# Altium schematic sheet SchematicSheet.SchDoc
size A3; SheetNumber: 1; SheetTotal: 1
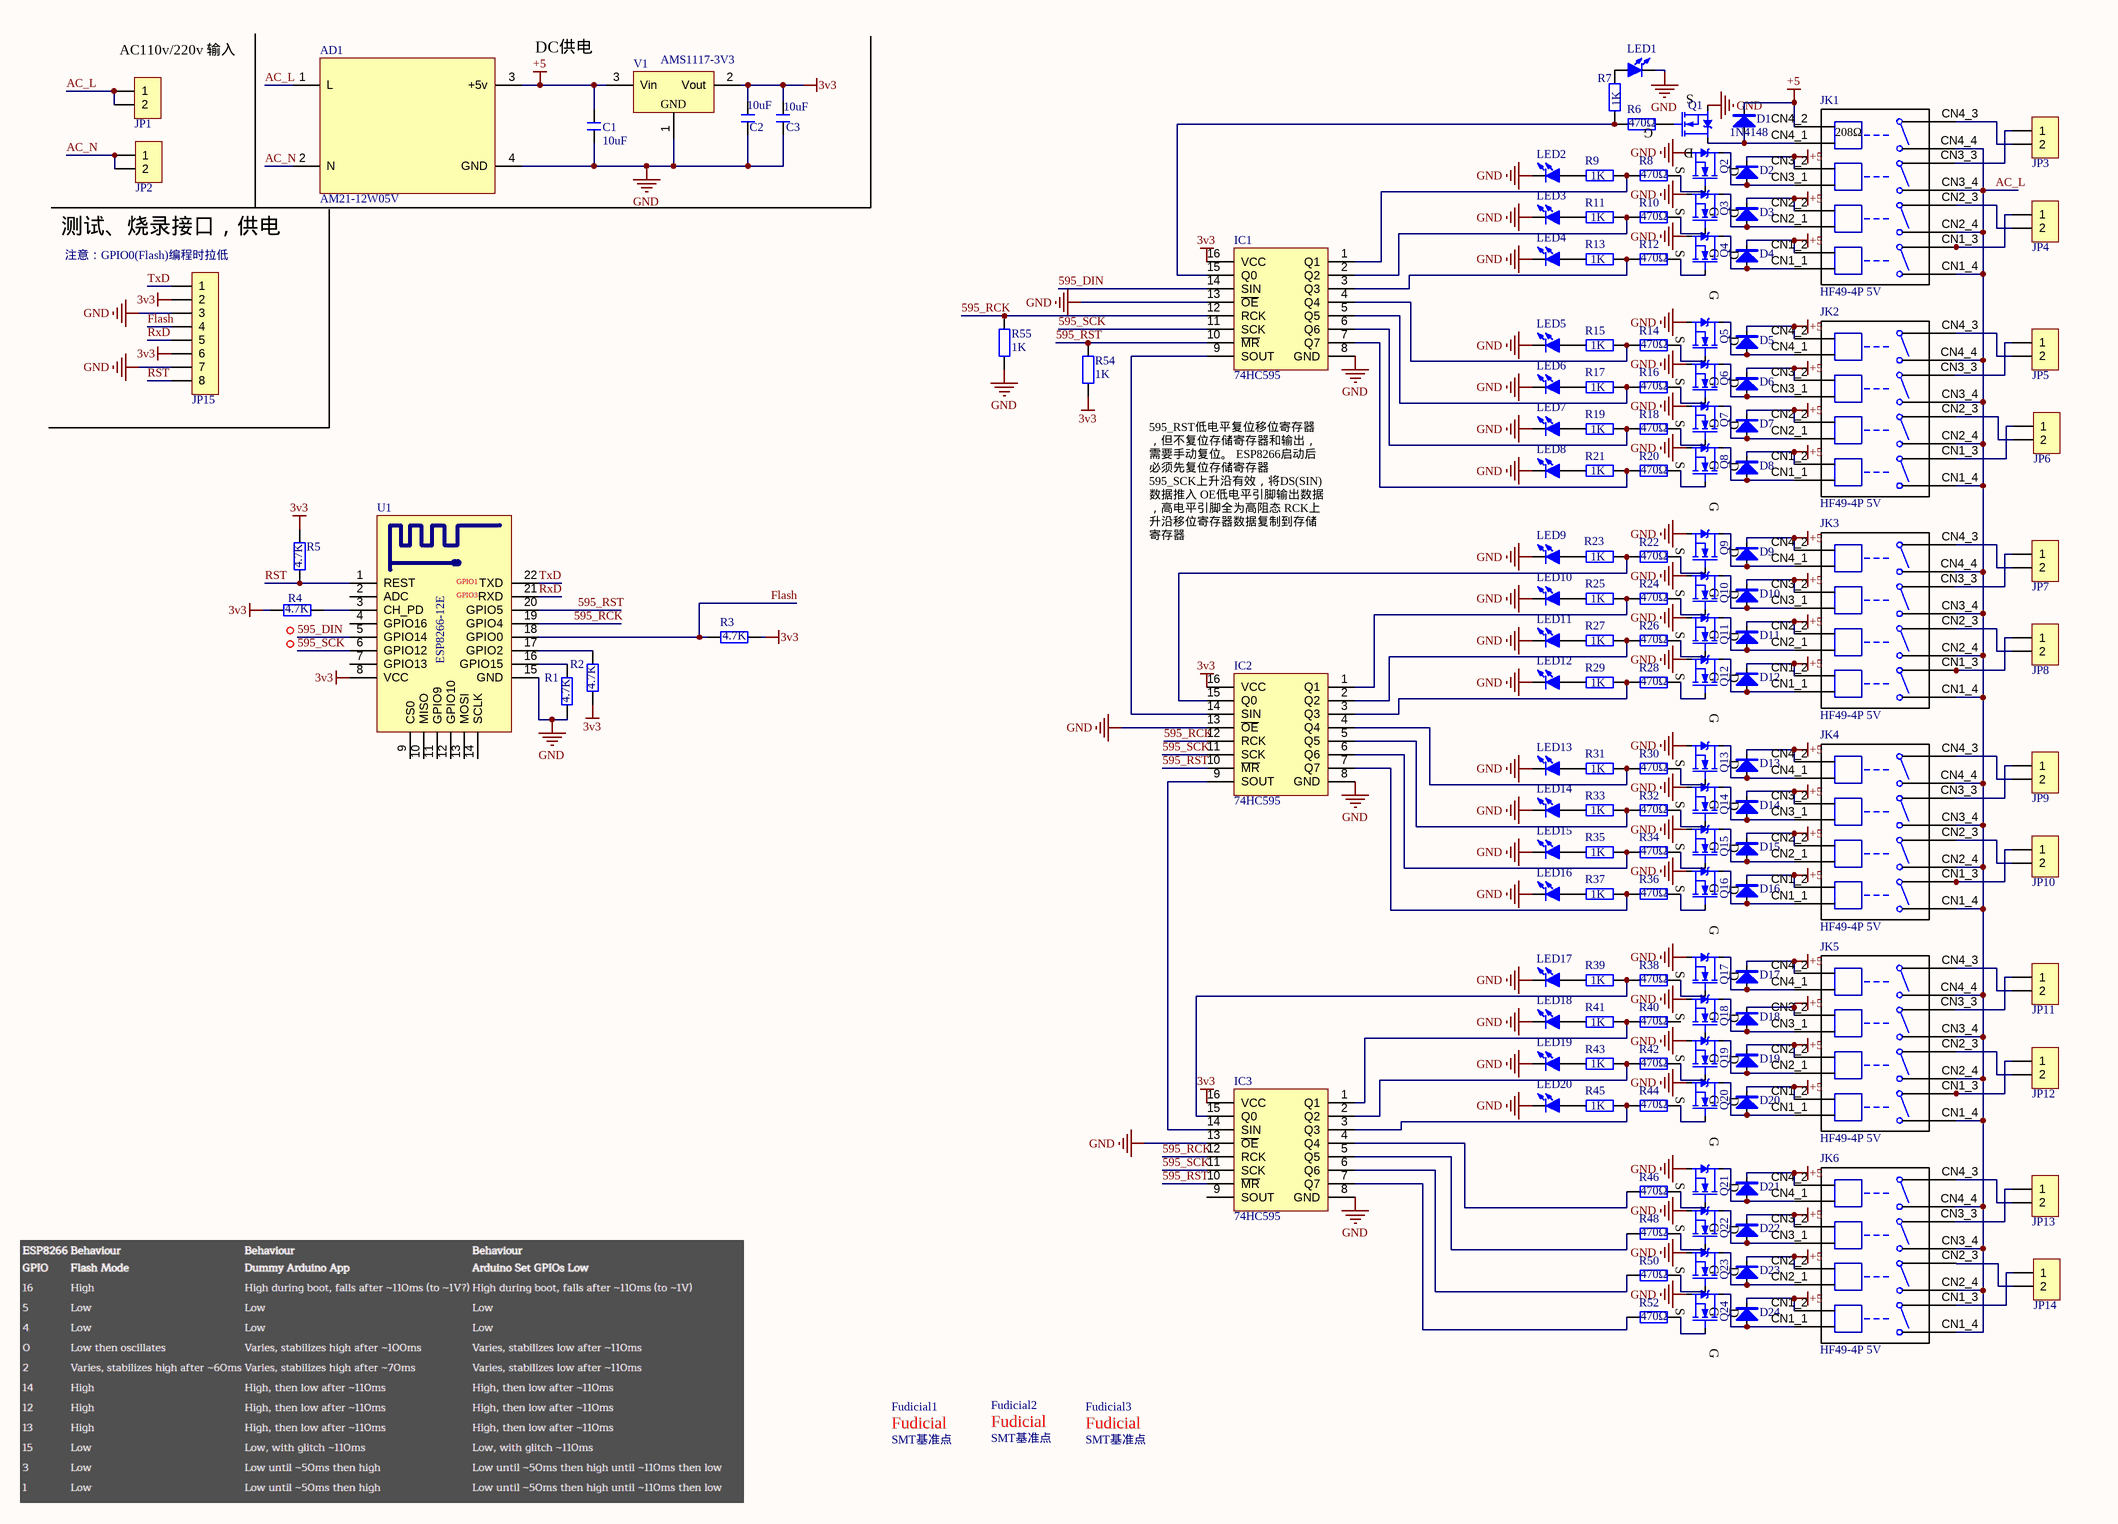
[diagram p0: SchematicSheet.SchDoc]

## Parts
AD1  AM21-12W05V  [AM21-xWxxV]
C1  10uF  [0603R]
C2  10uF  [0603R]
C3  10uF  [0603R]
D1  1N4148  [SOD-123]
D2  1N4148  [SOD-123]  (value not drawn)
D3  1N4148  [SOD-123]  (value not drawn)
D4  1N4148  [SOD-123]  (value not drawn)
D5  1N4148  [SOD-123]  (value not drawn)
D6  1N4148  [SOD-123]  (value not drawn)
D7  1N4148  [SOD-123]  (value not drawn)
D8  1N4148  [SOD-123]  (value not drawn)
D9  1N4148  [SOD-123]  (value not drawn)
D10  1N4148  [SOD-123]  (value not drawn)
D11  1N4148  [SOD-123]  (value not drawn)
D12  1N4148  [SOD-123]  (value not drawn)
D13  1N4148  [SOD-123]  (value not drawn)
D14  1N4148  [SOD-123]  (value not drawn)
D15  1N4148  [SOD-123]  (value not drawn)
D16  1N4148  [SOD-123]  (value not drawn)
D17  1N4148  [SOD-123]  (value not drawn)
D18  1N4148  [SOD-123]  (value not drawn)
D19  1N4148  [SOD-123]  (value not drawn)
D20  1N4148  [SOD-123]  (value not drawn)
D21  1N4148  [SOD-123]  (value not drawn)
D22  1N4148  [SOD-123]  (value not drawn)
D23  1N4148  [SOD-123]  (value not drawn)
D24  1N4148  [SOD-123]  (value not drawn)
Fudicial1  SMT基准点  [Fudicials]  (no BOM)
Fudicial2  SMT基准点  [Fudicials]  (no BOM)
Fudicial3  SMT基准点  [Fudicials]  (no BOM)
IC1  74HC595  [SOP16_M]
IC2  74HC595  [SOP16_M]
IC3  74HC595  [SOP16_M]
JK1  HF49-4P 5V  [HF49F-XXXX-1H11(1H12)-4P焊座]
JK2  HF49-4P 5V  [HF49F-XXXX-1H11(1H12)-4P焊座]
JK3  HF49-4P 5V  [HF49F-XXXX-1H11(1H12)-4P焊座]
JK4  HF49-4P 5V  [HF49F-XXXX-1H11(1H12)-4P焊座]
JK5  HF49-4P 5V  [HF49F-XXXX-1H11(1H12)-4P焊座]
JK6  HF49-4P 5V  [HF49F-XXXX-1H11(1H12)-4P焊座]
JP1  HDR-1X2  [KF301-5.0-2P]  (value not drawn)
JP2  HDR-1X2  [KF301-5.0-2P]  (value not drawn)
JP3  HDR-1X2  [KF301-5.0-2P]  (value not drawn)
JP4  HDR-1X2  [KF301-5.0-2P]  (value not drawn)
JP5  HDR-1X2  [KF301-5.0-2P]  (value not drawn)
JP6  HDR-1X2  [KF301-5.0-2P]  (value not drawn)
JP7  HDR-1X2  [KF301-5.0-2P]  (value not drawn)
JP8  HDR-1X2  [KF301-5.0-2P]  (value not drawn)
JP9  HDR-1X2  [KF301-5.0-2P]  (value not drawn)
JP10  HDR-1X2  [KF301-5.0-2P]  (value not drawn)
JP11  HDR-1X2  [KF301-5.0-2P]  (value not drawn)
JP12  HDR-1X2  [KF301-5.0-2P]  (value not drawn)
JP13  HDR-1X2  [KF301-5.0-2P]  (value not drawn)
JP14  HDR-1X2  [KF301-5.0-2P]  (value not drawn)
JP15  HDR-2X4  [1.27 2x4Pin]  (value not drawn)
LED1  红色  [LED 0603R]  (value not drawn)
LED2  红色  [LED 0603R]  (value not drawn)
LED3  红色  [LED 0603R]  (value not drawn)
LED4  红色  [LED 0603R]  (value not drawn)
LED5  红色  [LED 0603R]  (value not drawn)
LED6  红色  [LED 0603R]  (value not drawn)
LED7  红色  [LED 0603R]  (value not drawn)
LED8  红色  [LED 0603R]  (value not drawn)
LED9  红色  [LED 0603R]  (value not drawn)
LED10  红色  [LED 0603R]  (value not drawn)
LED11  红色  [LED 0603R]  (value not drawn)
LED12  红色  [LED 0603R]  (value not drawn)
LED13  红色  [LED 0603R]  (value not drawn)
LED14  红色  [LED 0603R]  (value not drawn)
LED15  红色  [LED 0603R]  (value not drawn)
LED16  红色  [LED 0603R]  (value not drawn)
LED17  红色  [LED 0603R]  (value not drawn)
LED18  红色  [LED 0603R]  (value not drawn)
LED19  红色  [LED 0603R]  (value not drawn)
LED20  红色  [LED 0603R]  (value not drawn)
Q1  AO3400  [SOT23]  (value not drawn)
Q2  AO3400  [SOT23]  (value not drawn)
Q3  AO3400  [SOT23]  (value not drawn)
Q4  AO3400  [SOT23]  (value not drawn)
Q5  AO3400  [SOT23]  (value not drawn)
Q6  AO3400  [SOT23]  (value not drawn)
Q7  AO3400  [SOT23]  (value not drawn)
Q8  AO3400  [SOT23]  (value not drawn)
Q9  AO3400  [SOT23]  (value not drawn)
Q10  AO3400  [SOT23]  (value not drawn)
Q11  AO3400  [SOT23]  (value not drawn)
Q12  AO3400  [SOT23]  (value not drawn)
Q13  AO3400  [SOT23]  (value not drawn)
Q14  AO3400  [SOT23]  (value not drawn)
Q15  AO3400  [SOT23]  (value not drawn)
Q16  AO3400  [SOT23]  (value not drawn)
Q17  AO3400  [SOT23]  (value not drawn)
Q18  AO3400  [SOT23]  (value not drawn)
Q19  AO3400  [SOT23]  (value not drawn)
Q20  AO3400  [SOT23]  (value not drawn)
Q21  AO3400  [SOT23]  (value not drawn)
Q22  AO3400  [SOT23]  (value not drawn)
Q23  AO3400  [SOT23]  (value not drawn)
Q24  AO3400  [SOT23]  (value not drawn)
R1  4.7K  [0603R]
R2  4.7K  [0603R]
R3  4.7K  [0603R]
R4  4.7K  [0603R]
R5  4.7K  [0603R]
R6  470Ω  [0603R]
R7  1K  [0603R]
R8  470Ω  [0603R]
R9  1K  [0603R]
R10  470Ω  [0603R]
R11  1K  [0603R]
R12  470Ω  [0603R]
R13  1K  [0603R]
R14  470Ω  [0603R]
R15  1K  [0603R]
R16  470Ω  [0603R]
R17  1K  [0603R]
R18  470Ω  [0603R]
R19  1K  [0603R]
R20  470Ω  [0603R]
R21  1K  [0603R]
R22  470Ω  [0603R]
R23  1K  [0603R]
R24  470Ω  [0603R]
R25  1K  [0603R]
R26  470Ω  [0603R]
R27  1K  [0603R]
R28  470Ω  [0603R]
R29  1K  [0603R]
R30  470Ω  [0603R]
R31  1K  [0603R]
R32  470Ω  [0603R]
R33  1K  [0603R]
R34  470Ω  [0603R]
R35  1K  [0603R]
R36  470Ω  [0603R]
R37  1K  [0603R]
R38  470Ω  [0603R]
R39  1K  [0603R]
R40  470Ω  [0603R]
R41  1K  [0603R]
R42  470Ω  [0603R]
R43  1K  [0603R]
R44  470Ω  [0603R]
R45  1K  [0603R]
R46  470Ω  [0603R]
R48  470Ω  [0603R]
R50  470Ω  [0603R]
R52  470Ω  [0603R]
R54  1K  [0603R]
R55  1K  [0603R]
U1  ESP8266-12E  [ESP_12E/F]
V1  AMS1117-3V3  [SOT223_N]

## Nets
3v3: C2.1 C3.1 IC1.16(VCC) IC2.16(VCC) IC3.16(VCC) JP15.2 JP15.6 R2.2 R3.2 R4.1 R5.2 R54.2 U1.8(VCC) V1.2(Vout)
+5: AD1.3(+5v) C1.1 D1.2(K) D2.2(K) D3.2(K) D4.2(K) D5.2(K) D6.2(K) D7.2(K) D8.2(K) D9.2(K) D10.2(K) D11.2(K) D12.2(K) D13.2(K) D14.2(K) D15.2(K) D16.2(K) D17.2(K) D18.2(K) D19.2(K) D20.2(K) D21.2(K) D22.2(K) D23.2(K) D24.2(K) JK1.CN1_2 JK1.CN2_2 JK1.CN3_2 JK1.CN4_2 JK2.CN1_2 JK2.CN2_2 JK2.CN3_2 JK2.CN4_2 JK3.CN1_2 JK3.CN2_2 JK3.CN3_2 JK3.CN4_2 JK4.CN1_2 JK4.CN2_2 JK4.CN3_2 JK4.CN4_2 JK5.CN1_2 JK5.CN2_2 JK5.CN3_2 JK5.CN4_2 JK6.CN1_2 JK6.CN2_2 JK6.CN3_2 JK6.CN4_2 V1.3(Vin)
GND: AD1.4(GND) C1.2 C2.2 C3.2 IC1.8(GND) IC1.13(~{OE}) IC2.8(GND) IC2.13(~{OE}) IC3.8(GND) IC3.13(~{OE}) JP15.3 JP15.7 LED1.2(K) LED2.2(K) LED3.2(K) LED4.2(K) LED5.2(K) LED6.2(K) LED7.2(K) LED8.2(K) LED9.2(K) LED10.2(K) LED11.2(K) LED12.2(K) LED13.2(K) LED14.2(K) LED15.2(K) LED16.2(K) LED17.2(K) LED18.2(K) LED19.2(K) LED20.2(K) Q1.3(S) Q2.3(S) Q3.3(S) Q4.3(S) Q5.3(S) Q6.3(S) Q7.3(S) Q8.3(S) Q9.3(S) Q10.3(S) Q11.3(S) Q12.3(S) Q13.3(S) Q14.3(S) Q15.3(S) Q16.3(S) Q17.3(S) Q18.3(S) Q19.3(S) Q20.3(S) Q21.3(S) Q22.3(S) Q23.3(S) Q24.3(S) R1.2 R55.2 U1.15(GND) V1.1(GND)
595_DIN: IC1.14(SIN) U1.5(GPIO14)
595_RCK: IC1.12(RCK) IC2.12(RCK) IC3.12(RCK) R55.1 U1.19(GPIO4)
595_RST: IC1.10(~{MR}) IC2.10(~{MR}) IC3.10(~{MR}) R54.1 U1.20(GPIO5)
595_SCK: IC1.11(SCK) IC2.11(SCK) IC3.11(SCK) U1.6(GPIO12)
AC_L: AD1.1(L) JK1.CN1_4 JK1.CN2_4 JK1.CN3_4 JK1.CN4_4 JK2.CN1_4 JK2.CN2_4 JK2.CN3_4 JK2.CN4_4 JK3.CN1_4 JK3.CN2_4 JK3.CN3_4 JK3.CN4_4 JK4.CN1_4 JK4.CN2_4 JK4.CN3_4 JK4.CN4_4 JK5.CN1_4 JK5.CN2_4 JK5.CN3_4 JK5.CN4_4 JK6.CN1_4 JK6.CN2_4 JK6.CN3_4 JK6.CN4_4 JP1.1 JP1.2
AC_N: AD1.2(N) JP2.1 JP2.2
Flash: JP15.4 R3.1 U1.18(GPIO0)
RST: JP15.8 R5.1 U1.1(REST)
RxD: JP15.5 U1.21(RXD)
TxD: JP15.1 U1.22(TXD)
NetD1_1: D1.1(A) JK1.CN4_1 Q1.2(D)
NetD2_1: D2.1(A) JK1.CN3_1 Q2.2(D)
NetD3_1: D3.1(A) JK1.CN2_1 Q3.2(D)
NetD4_1: D4.1(A) JK1.CN1_1 Q4.2(D)
NetD5_1: D5.1(A) JK2.CN4_1 Q5.2(D)
NetD6_1: D6.1(A) JK2.CN3_1 Q6.2(D)
NetD7_1: D7.1(A) JK2.CN2_1 Q7.2(D)
NetD8_1: D8.1(A) JK2.CN1_1 Q8.2(D)
NetD9_1: D9.1(A) JK3.CN4_1 Q9.2(D)
NetD10_1: D10.1(A) JK3.CN3_1 Q10.2(D)
NetD11_1: D11.1(A) JK3.CN2_1 Q11.2(D)
NetD12_1: D12.1(A) JK3.CN1_1 Q12.2(D)
NetD13_1: D13.1(A) JK4.CN4_1 Q13.2(D)
NetD14_1: D14.1(A) JK4.CN3_1 Q14.2(D)
NetD15_1: D15.1(A) JK4.CN2_1 Q15.2(D)
NetD16_1: D16.1(A) JK4.CN1_1 Q16.2(D)
NetD17_1: D17.1(A) JK5.CN4_1 Q17.2(D)
NetD18_1: D18.1(A) JK5.CN3_1 Q18.2(D)
NetD19_1: D19.1(A) JK5.CN2_1 Q19.2(D)
NetD20_1: D20.1(A) JK5.CN1_1 Q20.2(D)
NetD21_1: D21.1(A) JK6.CN4_1 Q21.2(D)
NetD22_1: D22.1(A) JK6.CN3_1 Q22.2(D)
NetD23_1: D23.1(A) JK6.CN2_1 Q23.2(D)
NetD24_1: D24.1(A) JK6.CN1_1 Q24.2(D)
NetIC1_1: IC1.1(Q1) R8.1 R9.1
NetIC1_2: IC1.2(Q2) R10.1 R11.1
NetIC1_3: IC1.3(Q3) R12.1 R13.1
NetIC1_4: IC1.4(Q4) R14.1 R15.1
NetIC1_5: IC1.5(Q5) R16.1 R17.1
NetIC1_6: IC1.6(Q6) R18.1 R19.1
NetIC1_7: IC1.7(Q7) R20.1 R21.1
NetIC1_9: IC1.9(SOUT) IC2.14(SIN)
NetIC1_15: IC1.15(Q0) R6.1 R7.1
NetIC2_1: IC2.1(Q1) R24.1 R25.1
NetIC2_2: IC2.2(Q2) R26.1 R27.1
NetIC2_3: IC2.3(Q3) R28.1 R29.1
NetIC2_4: IC2.4(Q4) R30.1 R31.1
NetIC2_5: IC2.5(Q5) R32.1 R33.1
NetIC2_6: IC2.6(Q6) R34.1 R35.1
NetIC2_7: IC2.7(Q7) R36.1 R37.1
NetIC2_9: IC2.9(SOUT) IC3.14(SIN)
NetIC2_15: IC2.15(Q0) R22.1 R23.1
NetIC3_1: IC3.1(Q1) R40.1 R41.1
NetIC3_2: IC3.2(Q2) R42.1 R43.1
NetIC3_3: IC3.3(Q3) R44.1 R45.1
NetIC3_4: IC3.4(Q4) R46.1
NetIC3_5: IC3.5(Q5) R48.1
NetIC3_6: IC3.6(Q6) R50.1
NetIC3_7: IC3.7(Q7) R52.1
NetIC3_15: IC3.15(Q0) R38.1 R39.1
NetJK1_CN1_3: JK1.CN1_3 JP4.1
NetJK1_CN2_3: JK1.CN2_3 JP4.2
NetJK1_CN3_3: JK1.CN3_3 JP3.1
NetJK1_CN4_3: JK1.CN4_3 JP3.2
NetJK2_CN1_3: JK2.CN1_3 JP6.1
NetJK2_CN2_3: JK2.CN2_3 JP6.2
NetJK2_CN3_3: JK2.CN3_3 JP5.1
NetJK2_CN4_3: JK2.CN4_3 JP5.2
NetJK3_CN1_3: JK3.CN1_3 JP8.1
NetJK3_CN2_3: JK3.CN2_3 JP8.2
NetJK3_CN3_3: JK3.CN3_3 JP7.1
NetJK3_CN4_3: JK3.CN4_3 JP7.2
NetJK4_CN1_3: JK4.CN1_3 JP10.1
NetJK4_CN2_3: JK4.CN2_3 JP10.2
NetJK4_CN3_3: JK4.CN3_3 JP9.1
NetJK4_CN4_3: JK4.CN4_3 JP9.2
NetJK5_CN1_3: JK5.CN1_3 JP12.1
NetJK5_CN2_3: JK5.CN2_3 JP12.2
NetJK5_CN3_3: JK5.CN3_3 JP11.1
NetJK5_CN4_3: JK5.CN4_3 JP11.2
NetJK6_CN1_3: JK6.CN1_3 JP14.1
NetJK6_CN2_3: JK6.CN2_3 JP14.2
NetJK6_CN3_3: JK6.CN3_3 JP13.1
NetJK6_CN4_3: JK6.CN4_3 JP13.2
NetLED1_1: LED1.1(A) R7.2
NetLED2_1: LED2.1(A) R9.2
NetLED3_1: LED3.1(A) R11.2
NetLED4_1: LED4.1(A) R13.2
NetLED5_1: LED5.1(A) R15.2
NetLED6_1: LED6.1(A) R17.2
NetLED7_1: LED7.1(A) R19.2
NetLED8_1: LED8.1(A) R21.2
NetLED9_1: LED9.1(A) R23.2
NetLED10_1: LED10.1(A) R25.2
NetLED11_1: LED11.1(A) R27.2
NetLED12_1: LED12.1(A) R29.2
NetLED13_1: LED13.1(A) R31.2
NetLED14_1: LED14.1(A) R33.2
NetLED15_1: LED15.1(A) R35.2
NetLED16_1: LED16.1(A) R37.2
NetLED17_1: LED17.1(A) R39.2
NetLED18_1: LED18.1(A) R41.2
NetLED19_1: LED19.1(A) R43.2
NetLED20_1: LED20.1(A) R45.2
NetQ1_1: Q1.1(G) R6.2
NetQ2_1: Q2.1(G) R8.2
NetQ3_1: Q3.1(G) R10.2
NetQ4_1: Q4.1(G) R12.2
NetQ5_1: Q5.1(G) R14.2
NetQ6_1: Q6.1(G) R16.2
NetQ7_1: Q7.1(G) R18.2
NetQ8_1: Q8.1(G) R20.2
NetQ9_1: Q9.1(G) R22.2
NetQ10_1: Q10.1(G) R24.2
NetQ11_1: Q11.1(G) R26.2
NetQ12_1: Q12.1(G) R28.2
NetQ13_1: Q13.1(G) R30.2
NetQ14_1: Q14.1(G) R32.2
NetQ15_1: Q15.1(G) R34.2
NetQ16_1: Q16.1(G) R36.2
NetQ17_1: Q17.1(G) R38.2
NetQ19_1: Q19.1(G) R42.2
NetQ20_1: Q20.1(G) R44.2
NetQ21_1: Q21.1(G) R46.2
NetQ22_1: Q22.1(G) R48.2
NetQ23_1: Q23.1(G) R50.2
NetQ24_1: Q24.1(G) R52.2
NetR1_1: R1.1 U1.16(GPIO15)
NetR2_1: R2.1 U1.17(GPIO2)
NetR4_2: R4.2 U1.3(CH_PD)

Not connected (* = marked no-connect by the designer): IC3 9(SOUT); Q18 1(G); R40 2; U1 2(ADC) 4(GPIO16) 7(GPIO13) 9(CS0) 10(MISO) 11(GPIO9) 12(GPIO10) 13(MOSI) 14(SCLK)

## Notes on the sheet
- (near JP1) AC110v/220v 输入
- DC供电
- (near JK1) 208Ω
- 测试、烧录接口，供电
- (near JP15) 注意：GPIO0(Flash)编程时拉低
- (near U1) GPIO1
- 595_RST低电平复位移位寄存器，但不复位存储寄存器和输出，需要手动复位。 ESP8266启动后必须先复位存储寄存器
  595_SCK上升沿有效，将DS(SIN)数据推入 OE低电平引脚输出数据，高电平引脚全为高阻态 RCK上升沿移位寄存器数据复制到存储寄存器
- (near U1) GPIO3
- THIS DOCUMENT AND THE DATA DISCLOSED HEREIN OR
- HEREWITH IS THE PROPERTY OF ALTIUM LIMITED AND MAY
- DWG NO:
- REVISION
- REV:
- DESCRIPTION
- DATE
- APPROVED
- BE FREELY DISTRIBUTED IN WHOLE. NO RIGHTS ARE
- RESERVED OR EXPRESS OR IMPLIED WARANTEE GIVEN.
- ENG:
- APPROVALS
- PROJECT
- DSN:
- CHK:
- REFERENCE DOCUMENTS
- PROJECT REVISION:
- TITLE
- DOCUMENT REVISION:
- DESIGN ITEM:
- BOM:
- FAB DWG:
- PCB DWG:
- ASSY DWG:
- SCALE:
- A3
- SIZE
- CAGE CODE
- FILE NAME
- DWG NO.
- SHEET
- OF
- REV

## Library data of the parts
AD1 = AM21-12W05V: 亿佰特AM21-12W05V AC-DC降压模块
C1-C3 = C: 无极性贴片电容; 版权归属: 源创客; BOM名称: 无极性贴片电容; 学习资源: www.ooocke.com
D1-D24 = 1N4148: 开关二极管; BOM名称: 肖特基二极管; 版权归属: 源创客; 属性: 40V/3A; 学习资源: www.ooocke.com
Fudicial1-Fudicial3 = Fudicial
IC1-IC3 = 74HC595: 8位移位寄存器; 版权归属: 源创客; BOM名称: 8位移位寄存器; 学习资源: www.ooocke.com
JK1-JK6 = HF49F-4P底座: HF49F-4P底座(兼容1H11/1H12); BOM名称: 单路常开继电器; 版权归属: 源创客; 学习资源: www.ooocke.com
JP1-JP14 = Header 2: 2P接插件; 版权归属: 源创客; BOM名称: 2P接插件; 学习资源: www.ooocke.com
JP15 = Header2x4: 8P接插件; 版权归属: 源创客; BOM名称: 8P接插件; 学习资源: www.ooocke.com
LED1-LED20 = LED-SMD: 贴片LED; 版权归属: 源创客; BOM名称: 贴片LED; 学习资源: www.ooocke.com
Q1-Q24 = AO3400: N沟场效应管; 版权归属: 源创客; BOM名称: N沟场效应管; 学习资源: www.ooocke.com
R1-R46 R48 R50 R52 R54 R55 = R: 贴片电阻; 版权归属: 源创客; BOM名称: 贴片电阻; 学习资源: www.ooocke.com
U1 = ESP8266-12E/F: 串口 WIFI模块，ESP-12E; BOM名称: WIFI模块; 版权归属: 源创客; 学习资源: www.ooocke.com
V1 = AMS1117: 三端稳压芯片; BOM名称: 稳压芯片; 版权归属: 源创客; 学习资源: www.ooocke.com